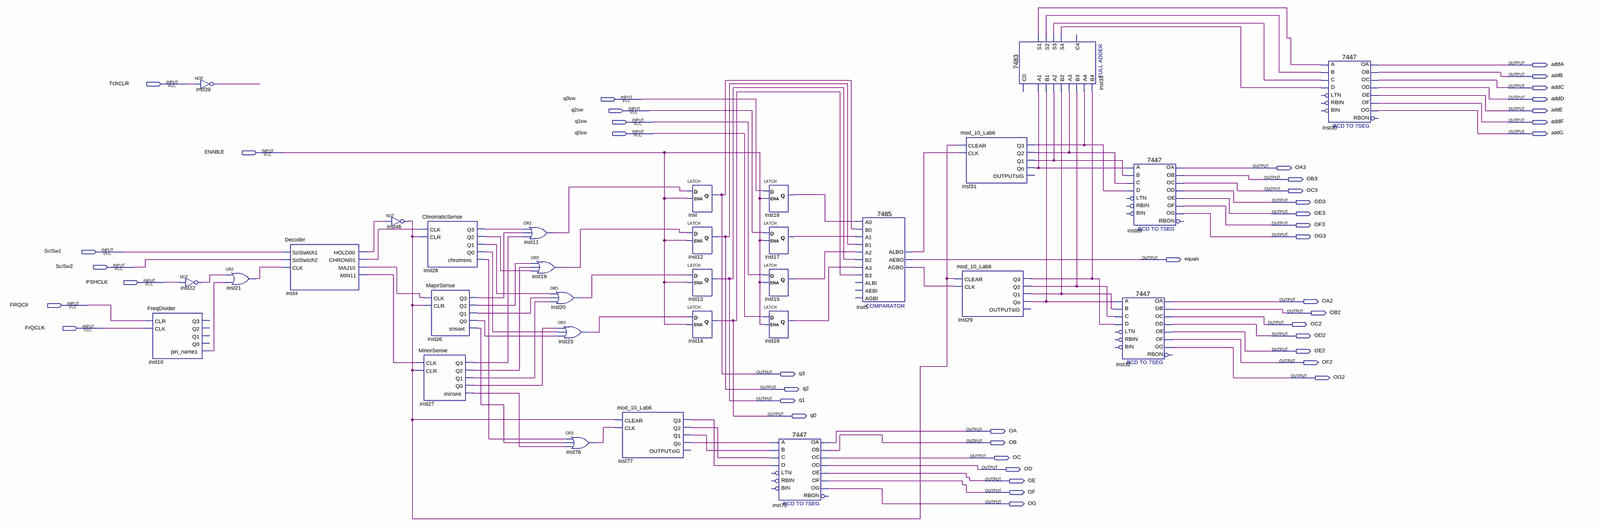
[diagram p0: schematic sheet, whole]
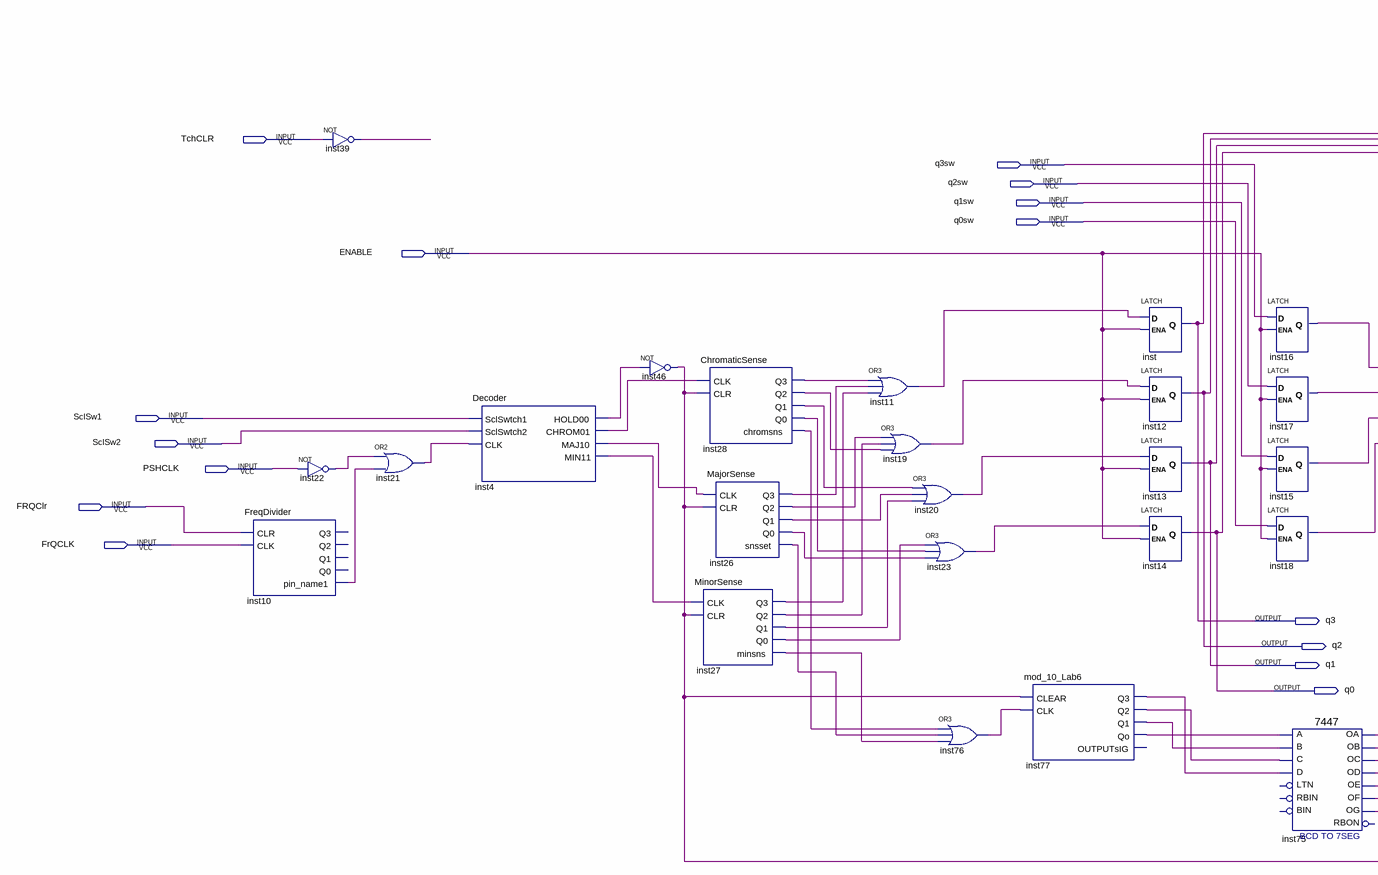
[diagram p1: schematic sheet, left part]
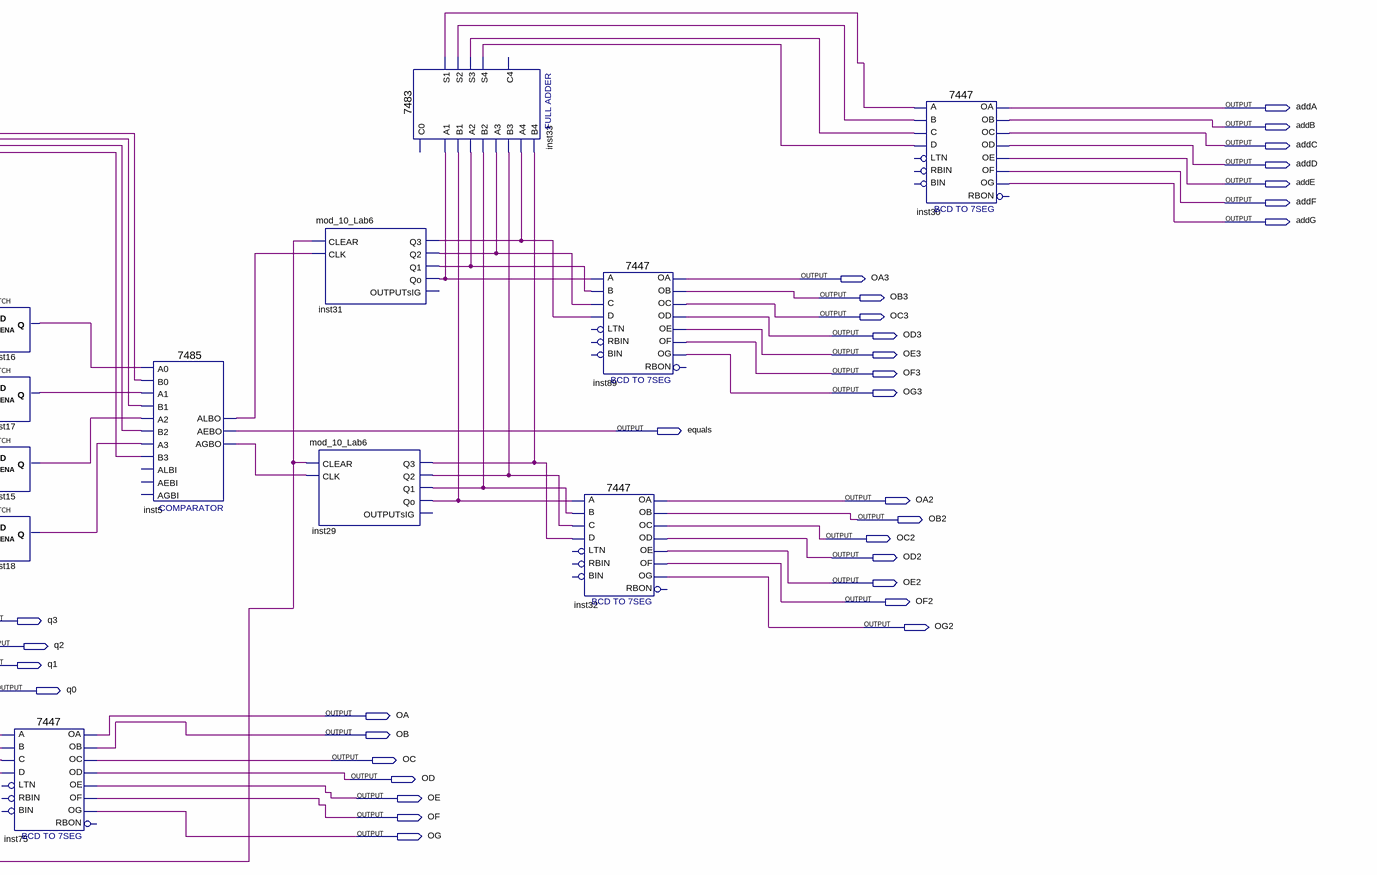
[diagram p2: schematic sheet, right part]
// Quartus schematic FinalCircuit.bdf as structural Verilog: 31 symbols, 44 pins
module FinalCircuit (
  input  TchCLR,
  input  q3sw,
  input  q2sw,
  input  q1sw,
  input  q0sw,
  input  ENABLE,
  input  SclSw1,
  input  SclSw2,
  input  PSHCLK,
  input  FRQClr,
  input  FrQCLK,
  output addA,
  output addB,
  output addC,
  output addD,
  output addE,
  output addF,
  output addG,
  output OA3,
  output OB3,
  output OC3,
  output OD3,
  output OE3,
  output OF3,
  output OG3,
  output equals,
  output OA2,
  output OB2,
  output OC2,
  output OD2,
  output OE2,
  output OF2,
  output q3,
  output OG2,
  output q2,
  output q1,
  output q0,
  output OA,
  output OB,
  output OC,
  output OD,
  output OE,
  output OF,
  output OG
);

  wire inst4_chrom01, inst4_hold00, inst4_maj10, inst4_min11, inst5_agbo, inst5_albo, inst10_pin_name1,
       inst11_out, inst15_q, inst16_q, inst17_q, inst18_q, inst19_out, inst20_out, inst21_out, inst22_out,
       inst23_out, inst26_q0, inst26_q1, inst26_q2, inst26_q3, inst26_snsset, inst27_minsns, inst27_q0,
       inst27_q1, inst27_q2, inst27_q3, inst28_chromsns, inst28_q0, inst28_q1, inst28_q2, inst28_q3,
       inst29_q1, inst29_q2, inst29_q3, inst29_qo, inst31_q1, inst31_q2, inst31_q3, inst31_qo, inst33_s1,
       inst33_s2, inst33_s3, inst33_s4, inst39_out, inst46_out, inst76_out, inst77_q1, inst77_q2, inst77_q3,
       inst77_qo;

  FreqDivider inst10 (.CLR(FRQClr), .CLK(FrQCLK), .pin_name1(inst10_pin_name1));  // open: Q3, Q2, Q1, Q0
  not inst22 (inst22_out, PSHCLK);
  not inst39 (inst39_out, TchCLR);
  or inst21 (inst21_out, inst22_out, inst10_pin_name1);
  Decoder inst4 (
    .SclSwtch1(SclSw1), .SclSwtch2(SclSw2), .CLK(inst21_out), .HOLD00(inst4_hold00), .CHROM01(inst4_chrom01),
    .MAJ10(inst4_maj10), .MIN11(inst4_min11));
  not inst46 (inst46_out, inst4_hold00);
  ChromaticSense inst28 (
    .CLK(inst4_chrom01), .CLR(inst46_out), .Q3(inst28_q3), .Q2(inst28_q2), .Q1(inst28_q1), .Q0(inst28_q0),
    .chromsns(inst28_chromsns));
  MajorSense inst26 (
    .CLK(inst4_maj10), .CLR(inst46_out), .Q3(inst26_q3), .Q2(inst26_q2), .Q1(inst26_q1), .Q0(inst26_q0),
    .snsset(inst26_snsset));
  MinorSense inst27 (
    .CLK(inst4_min11), .CLR(inst46_out), .Q3(inst27_q3), .Q2(inst27_q2), .Q1(inst27_q1), .Q0(inst27_q0),
    .minsns(inst27_minsns));
  or inst11 (inst11_out, inst28_q3, inst26_q3, inst27_q3);
  or inst19 (inst19_out, inst26_q2, inst27_q2, inst28_q2);
  or inst20 (inst20_out, inst28_q1, inst26_q1, inst27_q1);
  or inst23 (inst23_out, inst27_q0, inst28_q0, inst26_q0);
  or inst76 (inst76_out, inst28_chromsns, inst26_snsset, inst27_minsns);
  mod_10_Lab6 inst77 (
    .CLEAR(inst46_out), .CLK(inst76_out), .Q3(inst77_q3), .Q2(inst77_q2), .Q1(inst77_q1), .Qo(inst77_qo));  // open: OUTPUTsIG
  LATCH inst (.D(inst11_out), .ENA(ENABLE), .Q(q3));
  LATCH inst12 (.D(inst19_out), .ENA(ENABLE), .Q(q2));
  LATCH inst13 (.D(inst20_out), .ENA(ENABLE), .Q(q1));
  LATCH inst14 (.D(inst23_out), .ENA(ENABLE), .Q(q0));
  LATCH inst16 (.D(q3sw), .ENA(ENABLE), .Q(inst16_q));
  LATCH inst17 (.D(q2sw), .ENA(ENABLE), .Q(inst17_q));
  LATCH inst15 (.D(q1sw), .ENA(ENABLE), .Q(inst15_q));
  LATCH inst18 (.D(q0sw), .ENA(ENABLE), .Q(inst18_q));
  \7447  inst75 (
    .B(inst77_q1), .C(inst77_q2), .D(inst77_q3), .A(inst77_qo), .OB(OB), .OC(OC), .OE(OE), .OD(OD), .OF(OF),
    .OG(OG), .OA(OA));  // open: LTN, RBIN, BIN, RBON
  \7485  inst5 (
    .A3(inst18_q), .B2(q1), .A2(inst15_q), .A0(inst16_q), .B0(q3), .B3(q0), .A1(inst17_q), .B1(q2),
    .ALBO(inst5_albo), .AGBO(inst5_agbo), .AEBO(equals));  // open: AEBI, AGBI, ALBI
  mod_10_Lab6 inst31 (
    .CLEAR(inst46_out), .CLK(inst5_albo), .Q3(inst31_q3), .Q2(inst31_q2), .Q1(inst31_q1), .Qo(inst31_qo));  // open: OUTPUTsIG
  mod_10_Lab6 inst29 (
    .CLEAR(inst46_out), .CLK(inst5_agbo), .Q3(inst29_q3), .Q2(inst29_q2), .Q1(inst29_q1), .Qo(inst29_qo));  // open: OUTPUTsIG
  \7483  inst33 (
    .B4(inst29_q3), .A1(inst31_qo), .A2(inst31_q1), .B1(inst29_qo), .B2(inst29_q1), .A3(inst31_q2),
    .B3(inst29_q2), .A4(inst31_q3), .S3(inst33_s3), .S4(inst33_s4), .S2(inst33_s2), .S1(inst33_s1));  // open: C0, C4
  \7447  inst89 (
    .B(inst31_q1), .C(inst31_q2), .D(inst31_q3), .A(inst31_qo), .OB(OB3), .OC(OC3), .OE(OE3), .OD(OD3),
    .OF(OF3), .OG(OG3), .OA(OA3));  // open: LTN, RBIN, BIN, RBON
  \7447  inst32 (
    .B(inst29_q1), .C(inst29_q2), .D(inst29_q3), .A(inst29_qo), .OB(OB2), .OC(OC2), .OE(OE2), .OD(OD2),
    .OF(OF2), .OG(OG2), .OA(OA2));  // open: LTN, RBIN, BIN, RBON
  \7447  inst30 (
    .B(inst33_s2), .C(inst33_s3), .D(inst33_s4), .A(inst33_s1), .OB(addB), .OC(addC), .OE(addE), .OD(addD),
    .OF(addF), .OG(addG), .OA(addA));  // open: LTN, RBIN, BIN, RBON
endmodule
